# Altium schematic sheet ComputeUnit.SchDoc
size A4; SheetNumber: 3; SheetTotal: 4
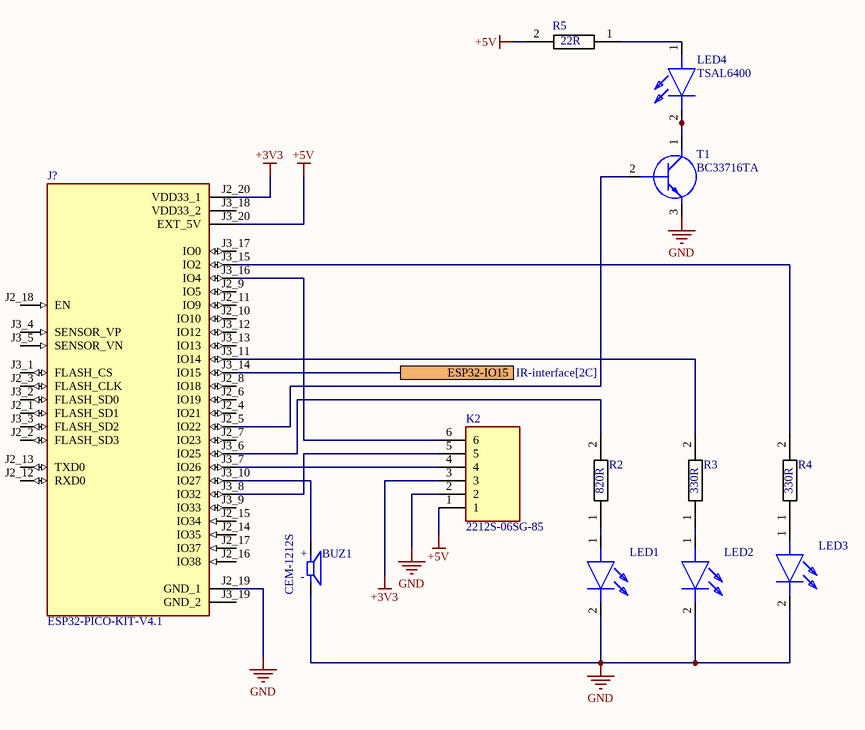
[diagram p0: ComputeUnit.SchDoc]

## Parts
BUZ1  CEM-1212S  [CUI_CEM-1212S]
J?  ESP32-PICO-KIT-V4.1  [XCVR_ESP32-PICO-KIT-V4.1]
K2  2212S-06SG-85  [RHDR6W74P0X254_1X6_1574X250X850P]
LED1  TLHO4200  [TLHO4200]  (value not drawn)
LED2  TLHO4200  [TLHO4200]  (value not drawn)
LED3  TLHO4200  [TLHO4200]  (value not drawn)
LED4  TSAL6400  [TSAL6400]
R2  820R  [RESC2012X60N]
R3  330R  [RESC2012X60N]
R4  330R  [RESC2012X60N]
R5  22R  [RESC2012X60N]
T1  BC33716TA  [BC33716TA]

## Ports
ESP32-IO15 (see IR-interface[2C])

## Nets
+3V3: J?.J2_20(VDD33_1) K2.3
+5V: J?.J3_20(EXT_5V) K2.1 R5.2
GND: BUZ1.M J?.J2_19(GND_1) K2.2 LED1.2(K) LED2.2(K) LED3.2(K) T1.3(E)
ESP32-IO15: J?.J3_14(IO15) ; port ESP32-IO15
NetBUZ1_P: BUZ1.P J?.J3_10(IO27)
NetJ?_J2_5: J?.J2_5(IO22) T1.2(B)
NetJ?_J3_6: J?.J3_6(IO25) R2.2
NetJ?_J3_7: J?.J3_7(IO26) K2.4
NetJ?_J3_8: J?.J3_8(IO32) K2.5
NetJ?_J3_11: J?.J3_11(IO14) R3.2
NetJ?_J3_15: J?.J3_15(IO2) R4.2
NetJ?_J3_16: J?.J3_16(IO4) K2.6
NetLED1_1: LED1.1(A) R2.1
NetLED2_1: LED2.1(A) R3.1
NetLED3_1: LED3.1(A) R4.1
NetLED4_1: LED4.1(A) R5.1
NetLED4_2: LED4.2(K) T1.1(C)

Not connected (* = marked no-connect by the designer): J? J2_1(FLASH_SD1) J2_2(FLASH_SD3) J2_3(FLASH_CLK) J2_4(IO21) J2_6(IO19) J2_7(IO23) J2_8(IO18) J2_9(IO5) J2_10(IO10) J2_11(IO9) J2_12(RXD0) J2_13(TXD0) J2_14(IO35) J2_15(IO34) J2_16(IO38) J2_17(IO37) J2_18(EN) J3_1(FLASH_CS) J3_2(FLASH_SD0) J3_3(FLASH_SD2) J3_4(SENSOR_VP) J3_5(SENSOR_VN) J3_9(IO33) J3_12(IO12) J3_13(IO13) J3_17(IO0) J3_18(VDD33_2) J3_19(GND_2)

## Notes on the sheet
- (in symbol CEM-1212S) +; -

## Library data of the parts
BUZ1 = CEM-1212S: 12 mm, 12 V, 85 dB, Through Hole, Sealed, Magnetic Audio Transducer Buzzer; MF: CUI Devices; Arrow_Electronics-Purchase-URL: https://snapeda.com/shop?store=Arrow+Electronics&id=601563; Value: *; SnapEDA_Link: https://www.snapeda.com/parts/CEM-1212S/CUI%20Devices/view-part/601563/?ref=snap; CUI_purchase_URL: https://www.cuidevices.com/product/audio/buzzers/audio-transducers/cem-1212s?utm_source=snapeda.com&utm_medium=referral&utm_campaign=snapedaBOM; MP: CEM-1212S; Availability: Good; Mouser-Purchase-URL: https://snapeda.com/shop?store=Mouser&id=601563; Price: None; DigiKey-Purchase-URL: https://snapeda.com/shop?store=DigiKey&id=601563; Package: TO-220 CUI Inc.
J? = ESP32-PICO-KIT-V4.1: WiFi Development Tools (802.11); MF: Espressif Systems; Price: None; Value: *; MP: ESP32-PICO-KIT-V4.1; Package: None; SnapEDA_Link: https://www.snapeda.com/parts/ESP32-PICO-KIT-V4.1/Espressif%20Systems/view-part/3211113/?ref=snap; Check_prices: https://www.snapeda.com/parts/ESP32-PICO-KIT-V4.1/Espressif%20Systems/view-part/3211113/?ref=eda; Availability: Bad
K2 = 2212S-06SG-85: Connector; Manufacturer_Name: Multicomp Pro; Datasheet Link: http://www.farnell.com/datasheets/2290158.pdf?_ga=2.3406896.1671530057.1506933545-2008293027.1497013038; Height: 8.5mm; Manufacturer_Part_Number: 2212S-06SG-85
LED1-LED3 = TLHO4200: LED; Manufacturer_Name: Vishay; Datasheet Link: https://www.mouser.com/datasheet/2/427/tlhg420-1767350.pdf; Height: 6.1mm; Manufacturer_Part_Number: TLHO4200
LED4 = TSAL6400: LED; Manufacturer_Name: Vishay; Datasheet Link: https://componentsearchengine.com/Datasheets/1/TSAL6400.pdf; Height: 9.7mm; Manufacturer_Part_Number: TSAL6400; Mouser Part Number: 782-TSAL6400; Mouser Price/Stock: https://www.mouser.co.uk/ProductDetail/Vishay-Semiconductors/TSAL6400?qs=oSAwVt7aKTHCOCv1ythi7g%3D%3D; Arrow Part Number: TSAL6400; Arrow Price/Stock: https://www.arrow.com/en/products/tsal6400/vishay?region=nac
R2-R5 = Resistor0805: Manufacturer_Name: Vishay; Manufacturer_Part_Number: CRCW08050000Z0EAHP; Datasheet Link: https://componentsearchengine.com/Datasheets/1/CRCW08051R00FKEAHP.pdf; Height: 0.6mm; Mouser Part Number: 71-CRCW08050000Z0EAH; Mouser Price/Stock: https://www.mouser.co.uk/ProductDetail/Vishay-Dale/CRCW08050000Z0EAHP?qs=pTGEtN%252BMLlDLrJUqQmN2jA%3D%3D; Arrow Part Number: CRCW08050000Z0EAHP; Arrow Price/Stock: https://www.arrow.com/en/products/crcw08050000z0eahp/vishay?region=nac
T1 = BC33716TA: Transistor BJT NPN; Manufacturer_Name: onsemi; Datasheet Link: https://rocelec.widen.net/view/pdf/hcqqbqwrik/ONSM-S-A0003590550-1.pdf?t.download=true&u=5oefqw; Height: 8.77mm; Manufacturer_Part_Number: BC33716TA; Mouser Part Number: 512-BC33716TA; Mouser Price/Stock: https://www.mouser.co.uk/ProductDetail/onsemi-Fairchild/BC33716TA?qs=UMEuL5FsraA5fR076NzQDQ%3D%3D; Arrow Part Number: BC33716TA; Arrow Price/Stock: https://www.arrow.com/en/products/bc33716ta/on-semiconductor?region=nac